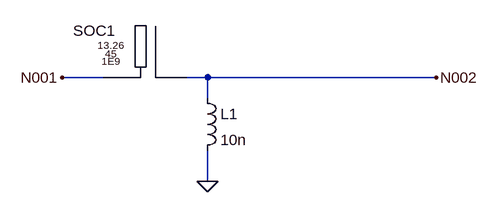
[diagram p0: schematic PasaAltasStubCapacitor.asc]
PasaAltasStubCapacitor.asc, the LTspice schematic file:
Version 4
SHEET 1 880 680
WIRE -144 96 -208 96
WIRE 16 96 -16 96
WIRE 368 96 16 96
WIRE 16 128 16 96
WIRE 16 256 16 208
FLAG 368 96 N002
FLAG -208 96 N001
FLAG 16 256 0
SYMBOL SOC -48 64 R0
SYMATTR SpiceModel 13.26
SYMATTR Value 45
SYMATTR Value2 1E9
SYMATTR InstName SOC1
SYMBOL ind 0 112 R0
SYMATTR InstName L1
SYMATTR Value 10n

The netlist it stands for:
* PasaAltasStubCapacitor.asc
SOC1 N001 N002 13.26 45 1E9
L1 N002 0 10n
.backanno
.end